# Altium project SimpleLDOConverter.PrjPcb
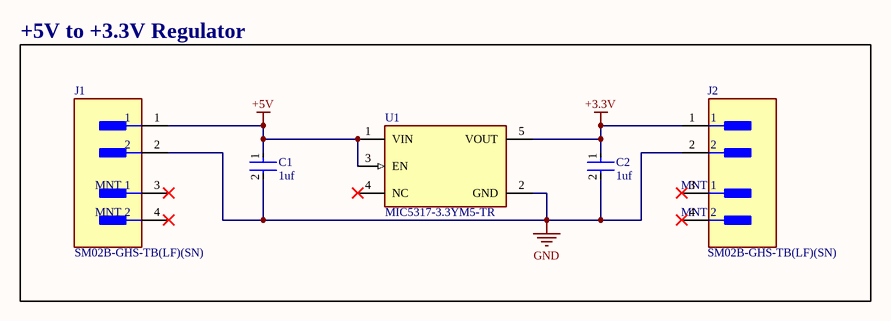
[diagram p0: LDOConverterSchematic.SchDoc]
1 sheet, 5 parts. Net scope: global (net labels, ports and power ports of the same name join across sheets).
Board file: LDOConverterPCB.PcbDoc

## Sheet LDOConverterSchematic.SchDoc
size A4; SheetNumber: 1; SheetTotal: 1

### Parts
C1  1uf  [FP-CC0805-0_85-MFG]
C2  1uf  [FP-CC0805-0_85-MFG]
J1  SM02B-GHS-TB(LF)(SN)  [FP-SM02B-GHS-TB_LF_SN-MFG]
J2  SM02B-GHS-TB(LF)(SN)  [FP-SM02B-GHS-TB_LF_SN-MFG]
U1  MIC5317-3.3YM5-TR  [FP-SOT23-5LD-PL-1-MFG]

### Blocks framed on the sheet
+5V to +3.3V Regulator: C1 C2 J1 J2 U1

### Nets
+3.3V: C2.1 J2.1 U1.5(VOUT)
+5V: C1.1 J1.1 U1.1(VIN) U1.3(EN)
GND: C1.2 C2.2 J1.2 J2.2 U1.2(GND)

Not connected (* = marked no-connect by the designer): J1 3(MNT_1)* 4(MNT_2)*; J2 3(MNT_1)* 4(MNT_2)*; U1 4(NC)*

### Library data of the parts
C1 C2 = CMP-03422-000746-1: CAP CER 1UF 10V X5R 0805; Manufacturer: Yageo; Manufacturer Part Number: CC0805KKX5R6BB105; Material: Ceramic; Tolerance: 0.1; Height: 0.95mm; Mouser Description: Multilayer Ceramic Capacitors MLCC - SMD/SMT 1.0uF 10V X5R 10%; Device Class L1: Passive Components; Temperature Range High: +85°C; ComponentLink2URL: http://www.yageo.com/documents/recent/UPY-GPHC_Y5V_6.3V-to-50V_8.pdf; Lead Free: Yes; Automotive: No; Package: CC0805-0.85; Temperature Range Low: -30°C; Device Class L2: Capacitors; Octopart: https://octopart.com/cc0805kkx5r6bb105-yageo-9292777; Category: Cap; Capacitance: 1 uF; Temperature: -30°C to +85°C; Device Class L3: Ceramic Capacitors; Value: 1 uF; ComponentLink2Description: Datasheet; Temperature Characteristic: X5R; Footprint Url: http://www.yageo.com/exep/pages/download/literatures/UPY-C_GEN_24.pdf; RoHS: TRUE; Ipc Land Pattern Name: CAPC200125X85; Voltage Rating: 10 V; Digikey Description: CAP CER 1UF 10V X5R 0805
J1 J2 = CMP-2000-07076-2: CONN HEADER SMD R/A 2POS 1.25MM; Voltage Rating: 50V; Number of Positions: 2; Pitch: 0.049inch; Current Rating: 1A; Connector Type: Outer Shroud Contact; Number of Rows: 1; Contact Material: Bronze; Termination: Solder; Color: Natural; Package Quantity: 2500; Mount: Surface Mount; Housing Color: Natural; Number of Contacts: 2; Packaging: Tape and Reel; Lead Free: Lead Free; Housing Material: Nylon; Orientation: Right Angle; Contact Type: Male Pin; Contact Plating: Tin; Series: GH; Fastening Type: Latch
U1 = CMP-06324-000116-1: IC REG LINEAR 3.3V 150MA SOT23-5; Max Input Voltage: 6V; Number of Regulators: 1; Min Current Limit: 200mA; Dropout Voltage: 155mV; Min Input Voltage: 2.5V; Power Supply Rejection Ratio (PSRR): 70dB; Case/Package: SOT-23-5; Output Voltage: 3.3V; Series: -; Max Operating Temperature: 125°C; Package Quantity: 3000; Mount: Surface Mount; Packaging: Tape and Reel; RoHS Compliant: No; Output Current: 150mA; Min Operating Temperature: -40°C; Number of Outputs: 1